# Altium project Mach_PLC_V1.0.PrjPcb
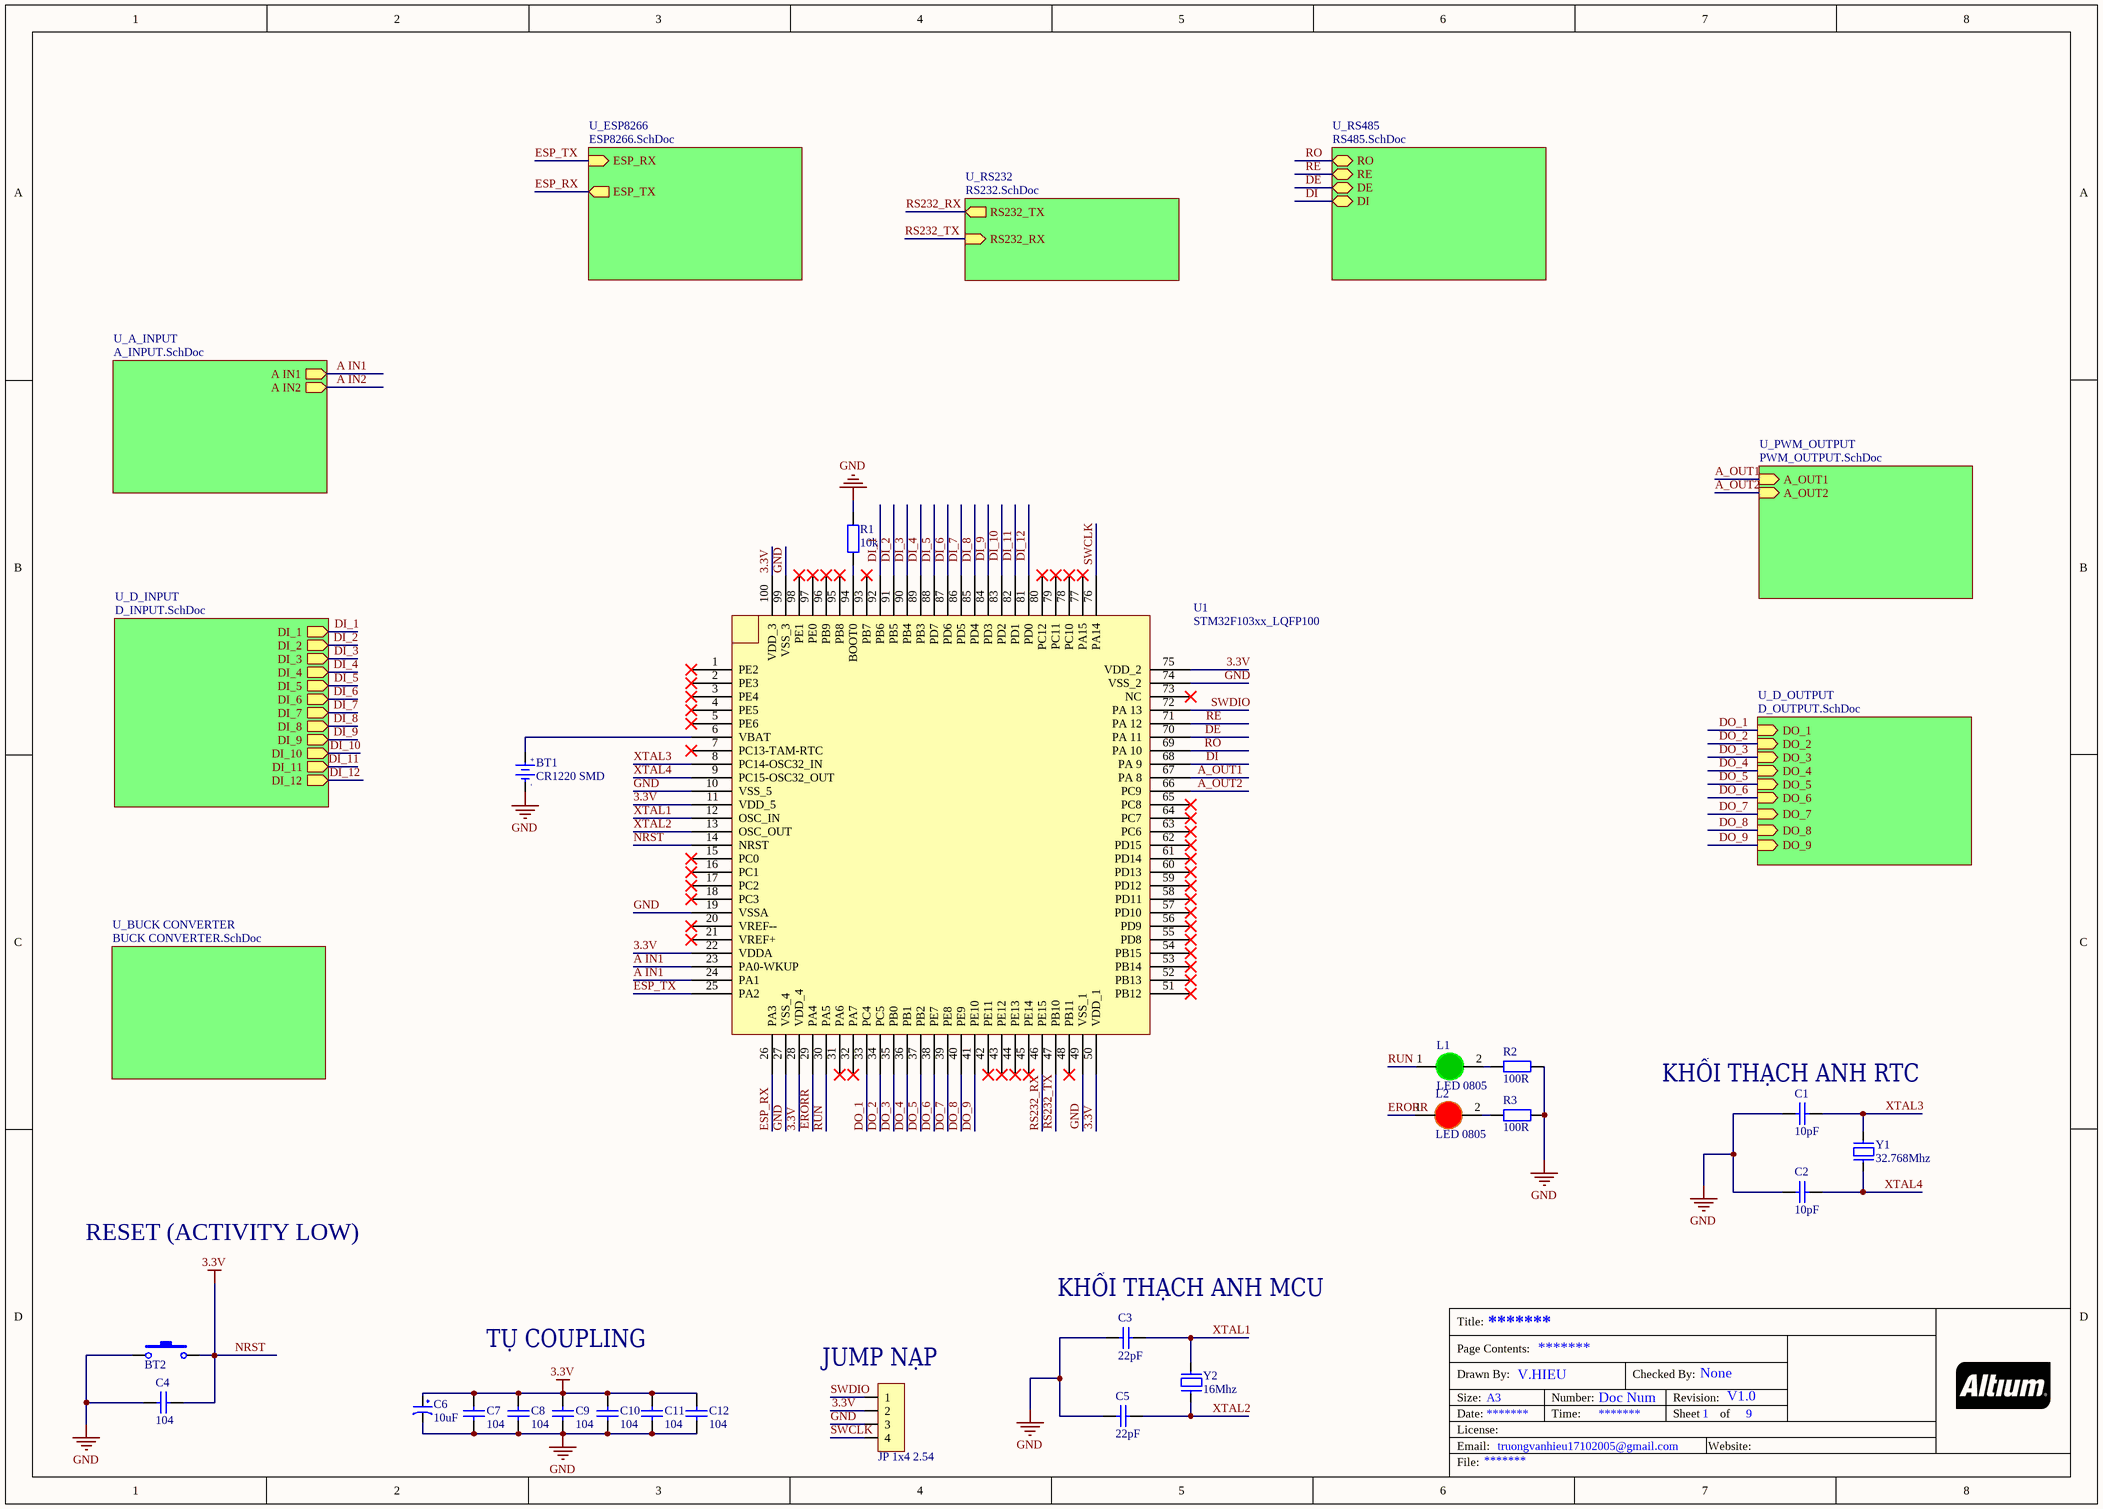
[diagram p0: Mach_PLC.SchDoc]
9 sheets, 145 parts. Net scope: hierarchical (ports join the sheet entries above them; power ports are global).
Board file: Mach_PLC.PcbDoc
Sheets:
  Mach_PLC.SchDoc
    U_D_OUTPUT = D_OUTPUT.SchDoc
    U_D_INPUT = D_INPUT.SchDoc
    U_RS232 = RS232.SchDoc
    U_RS485 = RS485.SchDoc
    U_ESP8266 = ESP8266.SchDoc
    U_A_INPUT = A_INPUT.SchDoc
    U_PWM_OUTPUT = PWM_OUTPUT.SchDoc
    U_BUCK CONVERTER = BUCK CONVERTER.SchDoc

## Sheet Mach_PLC.SchDoc
size A3; Date: *******; ApprovedBy: *******; CheckedBy: None; Author: *******; CompanyName: *******; DrawnBy: V.HIEU; Engineer: *******; Organization: *******; Address2: *******; Address3: *******; Address4: *******; DocumentNumber: Doc Num; Revision: V1.0; Email: truongvanhieu17102005@gmail.com; SheetNumber: 1; SheetTotal: 9; CurrentTime: *******; CurrentDate: *******; Time: *******; DocumentFullPathAndName: *******; DocumentName: *******; ModifiedDate: *******; ImagePath: *******; ProjectName: *******; Application_BuildNumber: *******

### Parts
BT1  CR1220 SMD  [DE PIN CR1220]
BT2  Nut Nhan 2 Chan SMD 3x6x2.5  [Nut Nhan 2 Chan SMD 3x6x2.5]  (value not drawn)
C1  10pF  [tu 0805]
C2  10pF  [tu 0805]
C3  22pF  [tu 0805]
C4  104  [tu 0805]
C5  22pF  [tu 0805]
C6  10uF  [tu tantalum smd3216]
C7  104  [tu 0805]
C8  104  [tu 0805]
C9  104  [tu 0805]
C10  104  [tu 0805]
C11  104  [tu 0805]
C12  104  [tu 0805]
JP1  JP 1x4 2.54  [JP 1x4 DT]
L1  LED 0805  [LED-0805-Green]
L2  LED 0805  [LED-0805-Red]
R1  10k  [tro smd 0805]
R2  100R  [tro smd 0805]
R3  100R  [tro smd 0805]
U1  STM32F103xx_LQFP100  [STM32_LQFP100]
Y1  32.768Mhz  [Thach Anh 2 Chan 32,768 KHz]
Y2  16Mhz  [Thach Anh 2 chan SMD]

### Sub-sheets
U_A_INPUT = A_INPUT.SchDoc: A IN1 (out), A IN2 (out)
U_BUCK CONVERTER = BUCK CONVERTER.SchDoc: no entries
U_D_INPUT = D_INPUT.SchDoc: DI_1 (out), DI_2 (out), DI_3 (out), DI_4 (out), DI_5 (out), DI_6 (out), DI_7 (out), DI_8 (out), DI_9 (out), DI_10 (out), DI_11 (out), DI_12 (out)
U_D_OUTPUT = D_OUTPUT.SchDoc: DO_1 (in), DO_2 (in), DO_3 (in), DO_4 (in), DO_9 (in), DO_5 (in), DO_8 (in), DO_7 (in), DO_6 (in)
U_ESP8266 = ESP8266.SchDoc: ESP_TX (out), ESP_RX (in)
U_PWM_OUTPUT = PWM_OUTPUT.SchDoc: A_OUT1 (in), A_OUT2 (in)
U_RS232 = RS232.SchDoc: RS232_RX (in), RS232_TX (out)
U_RS485 = RS485.SchDoc: RO (bidir), RE (bidir), DE (bidir), DI (bidir)

### Nets
3.3V: BT2.2 C4.2 C6.1 C7.1 C8.1 C9.1 C10.1 C11.1 C12.1 JP1.2 U1.11(VDD_5) U1.14(NRST) U1.22(VDDA) U1.28(VDD_4) U1.50(VDD_1) U1.75(VDD_2) U1.100(VDD_3)  [also labelled NRST]
GND: BT1.2(GND) BT2.1 C1.2 C2.2 C3.2 C4.1 C5.2 C6.2 C7.2 C8.2 C9.2 C10.2 C11.2 C12.2 JP1.3 R1.2 R2.2 R3.2 U1.10(VSS_5) U1.19(VSSA) U1.27(VSS_4) U1.49(VSS_1) U1.74(VSS_2) U1.99(VSS_3)
A IN1: U1.23(PA0-WKUP) U1.24(PA1) ; sheet U_A_INPUT/A IN1
A_OUT1: U1.67(PA_8) ; sheet U_PWM_OUTPUT/A_OUT1
A_OUT2: U1.66(PC9) ; sheet U_PWM_OUTPUT/A_OUT2
DE: U1.70(PA_11) ; sheet U_RS485/DE
DI: U1.68(PA_9) ; sheet U_RS485/DI
DI_1: U1.92(PB6) ; sheet U_D_INPUT/DI_1
DI_2: U1.91(PB5) ; sheet U_D_INPUT/DI_2
DI_3: U1.90(PB4) ; sheet U_D_INPUT/DI_3
DI_4: U1.89(PB3) ; sheet U_D_INPUT/DI_4
DI_5: U1.88(PD7) ; sheet U_D_INPUT/DI_5
DI_6: U1.87(PD6) ; sheet U_D_INPUT/DI_6
DI_7: U1.86(PD5) ; sheet U_D_INPUT/DI_7
DI_8: U1.85(PD4) ; sheet U_D_INPUT/DI_8
DI_9: U1.84(PD3) ; sheet U_D_INPUT/DI_9
DI_10: U1.83(PD2) ; sheet U_D_INPUT/DI_10
DI_11: U1.82(PD1) ; sheet U_D_INPUT/DI_11
DI_12: U1.81(PD0) ; sheet U_D_INPUT/DI_12
DO_1: U1.33(PC4) ; sheet U_D_OUTPUT/DO_1
DO_2: U1.34(PC5) ; sheet U_D_OUTPUT/DO_2
DO_3: U1.35(PB0) ; sheet U_D_OUTPUT/DO_3
DO_4: U1.36(PB1) ; sheet U_D_OUTPUT/DO_4
DO_5: U1.37(PB2) ; sheet U_D_OUTPUT/DO_5
DO_6: U1.38(PE7) ; sheet U_D_OUTPUT/DO_6
DO_7: U1.39(PE8) ; sheet U_D_OUTPUT/DO_7
DO_8: U1.40(PE9) ; sheet U_D_OUTPUT/DO_8
DO_9: U1.41(PE10) ; sheet U_D_OUTPUT/DO_9
ERORR: L2.1(A) U1.29(PA4)
ESP_RX: U1.26(PA3) ; sheet U_ESP8266/ESP_TX
ESP_TX: U1.25(PA2) ; sheet U_ESP8266/ESP_RX
RE: U1.71(PA_12) ; sheet U_RS485/RE
RO: U1.69(PA_10) ; sheet U_RS485/RO
RS232_RX: U1.46(PE15) ; sheet U_RS232/RS232_TX
RS232_TX: U1.47(PB10) ; sheet U_RS232/RS232_RX
RUN: L1.1(A) U1.30(PA5)
SWCLK: JP1.4 U1.76(PA14)
SWDIO: JP1.1 U1.72(PA_13)
XTAL1: C3.1 U1.12(OSC_IN) Y2.2
XTAL2: C5.1 U1.13(OSC_OUT) Y2.1
XTAL3: C1.1 U1.8(PC14-OSC32_IN) Y1.2
XTAL4: C2.1 U1.9(PC15-OSC32_OUT) Y1.1
NetBT1_1: BT1.1(+3V) U1.6(VBAT)
NetL1_2: L1.2(K) R2.1
NetL2_2: L2.2(K) R3.1
NetR1_1: R1.1 U1.94(BOOT0)

Not connected (* = marked no-connect by the designer): U1 1(PE2)* 2(PE3)* 3(PE4)* 4(PE5)* 5(PE6)* 7(PC13-TAM-RTC)* 15(PC0)* 16(PC1)* 17(PC2)* 18(PC3)* 20(VREF--)* 21(VREF+)* 31(PA6)* 32(PA7)* 42(PE11)* 43(PE12)* 44(PE13)* 45(PE14)* 48(PB11)* 51(PB12)* 52(PB13)* 53(PB14)* 54(PB15)* 55(PD8)* 56(PD9)* 57(PD10)* 58(PD11)* 59(PD12)* 60(PD13)* 61(PD14)* 62(PD15)* 63(PC6)* 64(PC7)* 65(PC8)* 73(NC)* 77(PA15)* 78(PC10)* 79(PC11)* 80(PC12)* 93(PB7)* 95(PB8)* 96(PB9)* 97(PE0)* 98(PE1)*

### Notes on the sheet
- (near C1) KHỐI THẠCH ANH RTC
- RESET (ACTIVITY LOW)
- (near C3) KHỐI THẠCH ANH MCU
- TỤ COUPLING
- (near JP1) JUMP NẠP
- Title:
- Size:
- Drawn By:
- Page Contents:
- A3
- Number:
- Checked By:
- Revision:
- Date:
- File:
- License:
- Email:
- Time:
- Sheet
- Website:
- of
- (in symbol De pin CR1220 SMD) +; -

### Library data of the parts
BT1 = De pin CR1220 SMD: Ten: Đế PIN CR1220 SMD; Ma_Hang: MH000833
BT2 = Nut Nhan 2 Chan SMD 3x6x2.5: Ma_Hang: MH001036; Ten: Nút Nhấn 2 Chân 3x6x2.5MM SMD
C1 C2 = Tu 0805 10pF 50V 10%: Dán; Don_Vi: Con; So_Chan: 2; Ten_Linh_Kien: Tụ 0805 10P 10% 50V; Ma_Hang: MH004554; Chung_Loai: Dán; Kieu_Chan: *
C3 C5 = Tu 0805 22pF 50V 10%: Dán; Don_Vi: Con; So_Chan: 2; Ten_Linh_Kien: Tụ 0805 22P 10% 50V; Ma_Hang: MH004560; Chung_Loai: Dán; Kieu_Chan: *
C4 C7-C12 = Tu 0805 104 50V 10%: Dán; Don_Vi: Con; So_Chan: 2; Ten_Linh_Kien: Tụ 0805 104-100nF 10% 50V; Ma_Hang: MH004551; Chung_Loai: Dán; Kieu_Chan: *
C6 = Tu tantalum 10uF 16V SMD3216: Dán; Don_Vi: Con; So_Chan: 2; Ten_Linh_Kien: Tụ tantalum 106C-10uF 16V SMD3216; Ma_Hang: MH001954; Chung_Loai: Dán; Kieu_Chan: *
JP1 = JP 1x4 2.54 Duc Thang: Cắm; Ten_Linh_Kien: Jump Đơn Đực 2.54MM 1x40P Thẳng 11MM; Don_Vi: Con; Ma_Hang: MH000903; Ghi_Chu: *; Kieu_Chan: *; Chung_Loai: Cắm
L1 = LED 0805 Xanh La: Dán; Don_Vi: Con; Ma_Hang: MH002326; Ten_Linh_Kien: LED 0805 Màu Xanh Lá (Green); Ghi_Chu: *; Kieu_Chan: *; Chung_Loai: Dán
L2 = LED 0805 Do: Dán; Don_Vi: Con; Ma_Hang: MH000897; Ten_Linh_Kien: LED 0805 Màu Đỏ (Red); Ghi_Chu: *; Kieu_Chan: *; Chung_Loai: Dán
R1 = Tro 0805 1% 10k: Dán; Don_Vi: Con; So_Chan: 2; Ten_Linh_Kien: Trở 0805 1% 10k; Ma_Hang: MH005473; Chung_Loai: Dán; Kieu_Chan: *
R2 R3 = Tro 0805 5% 100R: Dán; Don_Vi: Con; So_Chan: 2; Ten_Linh_Kien: Trở 0805 5% 100R; Ma_Hang: MH005251; Chung_Loai: Dán; Kieu_Chan: *
Y1 = Thach Anh 2 chan 32,768 Khz: Crystal For all Crystal 2pin.; Value: 4Mhz
Y2 = Thach Anh 2 chan SMD: Crystal For all Crystal 2pin.; Value: 4Mhz

## Sheet D_OUTPUT.SchDoc
size A3; Date: *******; ApprovedBy: *******; CheckedBy: None; Author: *******; CompanyName: *******; DrawnBy: V.HIEU; Engineer: *******; Organization: *******; Address2: *******; Address3: *******; Address4: *******; DocumentNumber: Doc Num; Revision: V1.0; Email: truongvanhieu17102005@gmail.com; CurrentTime: *******; CurrentDate: *******; Time: *******; DocumentFullPathAndName: *******; DocumentName: *******; ModifiedDate: *******; ImagePath: *******; ProjectName: *******; Application_BuildNumber: *******
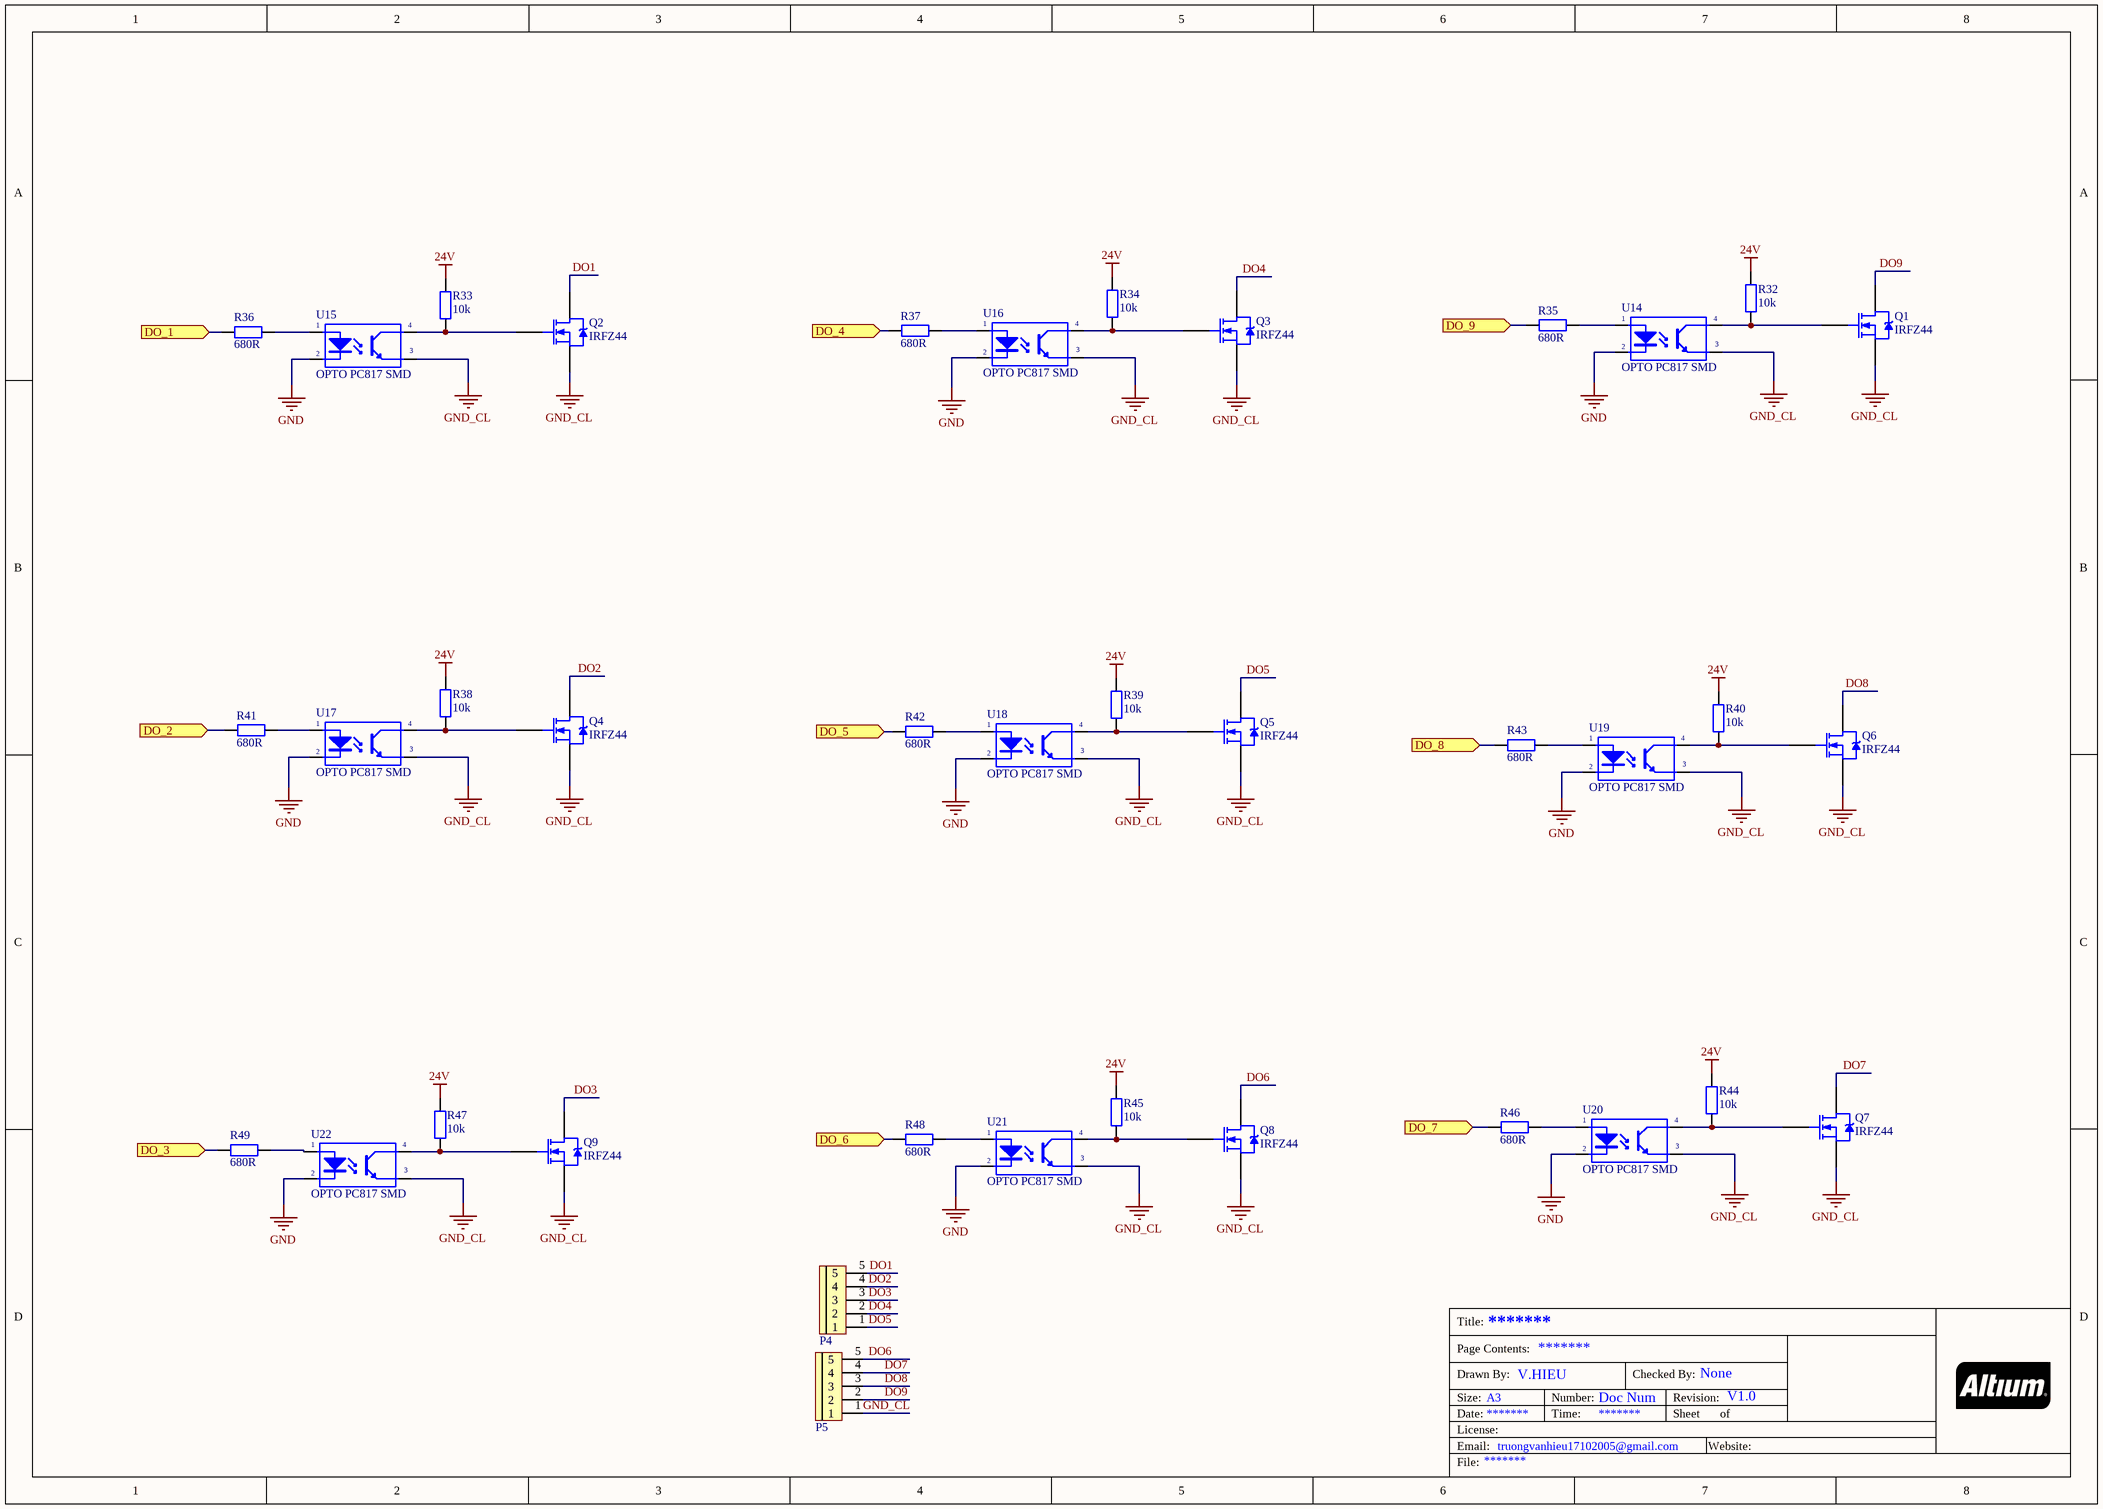
[diagram p1: D_OUTPUT.SchDoc]

### Parts
P4  CON 5 EDG5.08  [CON 5 5EDG5.08]  (value not drawn)
P5  CON 5 EDG5.08  [CON 5 5EDG5.08]  (value not drawn)
Q1  IRFZ44  [TO220]
Q2  IRFZ44  [TO220]
Q3  IRFZ44  [TO220]
Q4  IRFZ44  [TO220]
Q5  IRFZ44  [TO220]
Q6  IRFZ44  [TO220]
Q7  IRFZ44  [TO220]
Q8  IRFZ44  [TO220]
Q9  IRFZ44  [TO220]
R32  10k  [tro smd 0805]
R33  10k  [tro smd 0805]
R34  10k  [tro smd 0805]
R35  680R  [Tro SMD 0805]
R36  680R  [Tro SMD 0805]
R37  680R  [Tro SMD 0805]
R38  10k  [tro smd 0805]
R39  10k  [tro smd 0805]
R40  10k  [tro smd 0805]
R41  680R  [Tro SMD 0805]
R42  680R  [Tro SMD 0805]
R43  680R  [Tro SMD 0805]
R44  10k  [tro smd 0805]
R45  10k  [tro smd 0805]
R46  680R  [Tro SMD 0805]
R47  10k  [tro smd 0805]
R48  680R  [Tro SMD 0805]
R49  680R  [Tro SMD 0805]
U14  OPTO PC817 SMD  [SOP4]
U15  OPTO PC817 SMD  [SOP4]
U16  OPTO PC817 SMD  [SOP4]
U17  OPTO PC817 SMD  [SOP4]
U18  OPTO PC817 SMD  [SOP4]
U19  OPTO PC817 SMD  [SOP4]
U20  OPTO PC817 SMD  [SOP4]
U21  OPTO PC817 SMD  [SOP4]
U22  OPTO PC817 SMD  [SOP4]

### Ports
DO_1 (in), DO_2 (in), DO_3 (in), DO_4 (in), DO_5 (in), DO_6 (in), DO_7 (in), DO_8 (in), DO_9 (in)

### Nets
24V: R32.1 R33.1 R34.1 R38.1 R39.1 R40.1 R44.1 R45.1 R47.1
GND: U14.2(K) U15.2(K) U16.2(K) U17.2(K) U18.2(K) U19.2(K) U20.2(K) U21.2(K) U22.2(K)
GND_CL: P5.1 Q1.3(S) Q2.3(S) Q3.3(S) Q4.3(S) Q5.3(S) Q6.3(S) Q7.3(S) Q8.3(S) Q9.3(S) U14.3(E) U15.3(E) U16.3(E) U17.3(E) U18.3(E) U19.3(E) U20.3(E) U21.3(E) U22.3(E)
DO1: P4.5 Q2.2(D)
DO2: P4.4 Q4.2(D)
DO3: P4.3 Q9.2(D)
DO4: P4.2 Q3.2(D)
DO5: P4.1 Q5.2(D)
DO6: P5.5 Q8.2(D)
DO7: P5.4 Q7.2(D)
DO8: P5.3 Q6.2(D)
DO9: P5.2 Q1.2(D)
DO_1: R36.1 ; port DO_1
DO_2: R41.1 ; port DO_2
DO_3: R49.1 ; port DO_3
DO_4: R37.1 ; port DO_4
DO_5: R42.1 ; port DO_5
DO_6: R48.1 ; port DO_6
DO_7: R46.1 ; port DO_7
DO_8: R43.1 ; port DO_8
DO_9: R35.1 ; port DO_9
NetQ1_1: Q1.1(G) R32.2 U14.4(C)
NetQ2_1: Q2.1(G) R33.2 U15.4(C)
NetQ3_1: Q3.1(G) R34.2 U16.4(C)
NetQ4_1: Q4.1(G) R38.2 U17.4(C)
NetQ5_1: Q5.1(G) R39.2 U18.4(C)
NetQ6_1: Q6.1(G) R40.2 U19.4(C)
NetQ7_1: Q7.1(G) R44.2 U20.4(C)
NetQ8_1: Q8.1(G) R45.2 U21.4(C)
NetQ9_1: Q9.1(G) R47.2 U22.4(C)
NetR35_2: R35.2 U14.1(A)
NetR36_2: R36.2 U15.1(A)
NetR37_2: R37.2 U16.1(A)
NetR41_2: R41.2 U17.1(A)
NetR42_2: R42.2 U18.1(A)
NetR43_2: R43.2 U19.1(A)
NetR46_2: R46.2 U20.1(A)
NetR48_2: R48.2 U21.1(A)
NetR49_2: R49.2 U22.1(A)

### Notes on the sheet
- Title:
- Size:
- Drawn By:
- Page Contents:
- A3
- Number:
- Checked By:
- Revision:
- Date:
- File:
- License:
- Email:
- Time:
- Sheet
- Website:
- of

### Library data of the parts
P4 P5 = CON 5 EDG5.08: Cắm; Ten_Linh_Kien: CON 5 2EDG5.08-5P 5.08MM ( Xanh Cong); Ma_Hang: MH003589; Kieu_Chan: *; Don_Vi: Con; Ghi_Chu: *; Chung_Loai: Cắm
Q1-Q9 = FET IRFZ44 DIP: TO-220
R32-R34 R38-R40 R44 R45 R47 = Tro 0805 1% 10k: as R1 on sheet Mach_PLC; Chung_Loai: Dán; Kieu_Chan: *
R35-R37 R41-R43 R46 R48 R49 = Tro 0805 5% 680R: Dán; Don_Vi: Con; Ma_Hang: MH005344; So_Chan: 2; Ten_Linh_Kien: Trở 0805 5% 680R; Chung_Loai: Dán; Kieu_Chan: *
U14-U22 = OPTO PC817 SMD: Single Opto; Value: PC817

## Sheet D_INPUT.SchDoc
size A3; Date: *******; ApprovedBy: *******; CheckedBy: None; Author: *******; CompanyName: *******; DrawnBy: V.HIEU; Engineer: *******; Organization: *******; Address2: *******; Address3: *******; Address4: *******; DocumentNumber: Doc Num; Revision: V1.0; Email: truongvanhieu17102005@gmail.com; SheetNumber: 3; SheetTotal: 9; CurrentTime: *******; CurrentDate: *******; Time: *******; DocumentFullPathAndName: *******; DocumentName: *******; ModifiedDate: *******; ImagePath: *******; ProjectName: *******; Application_BuildNumber: *******
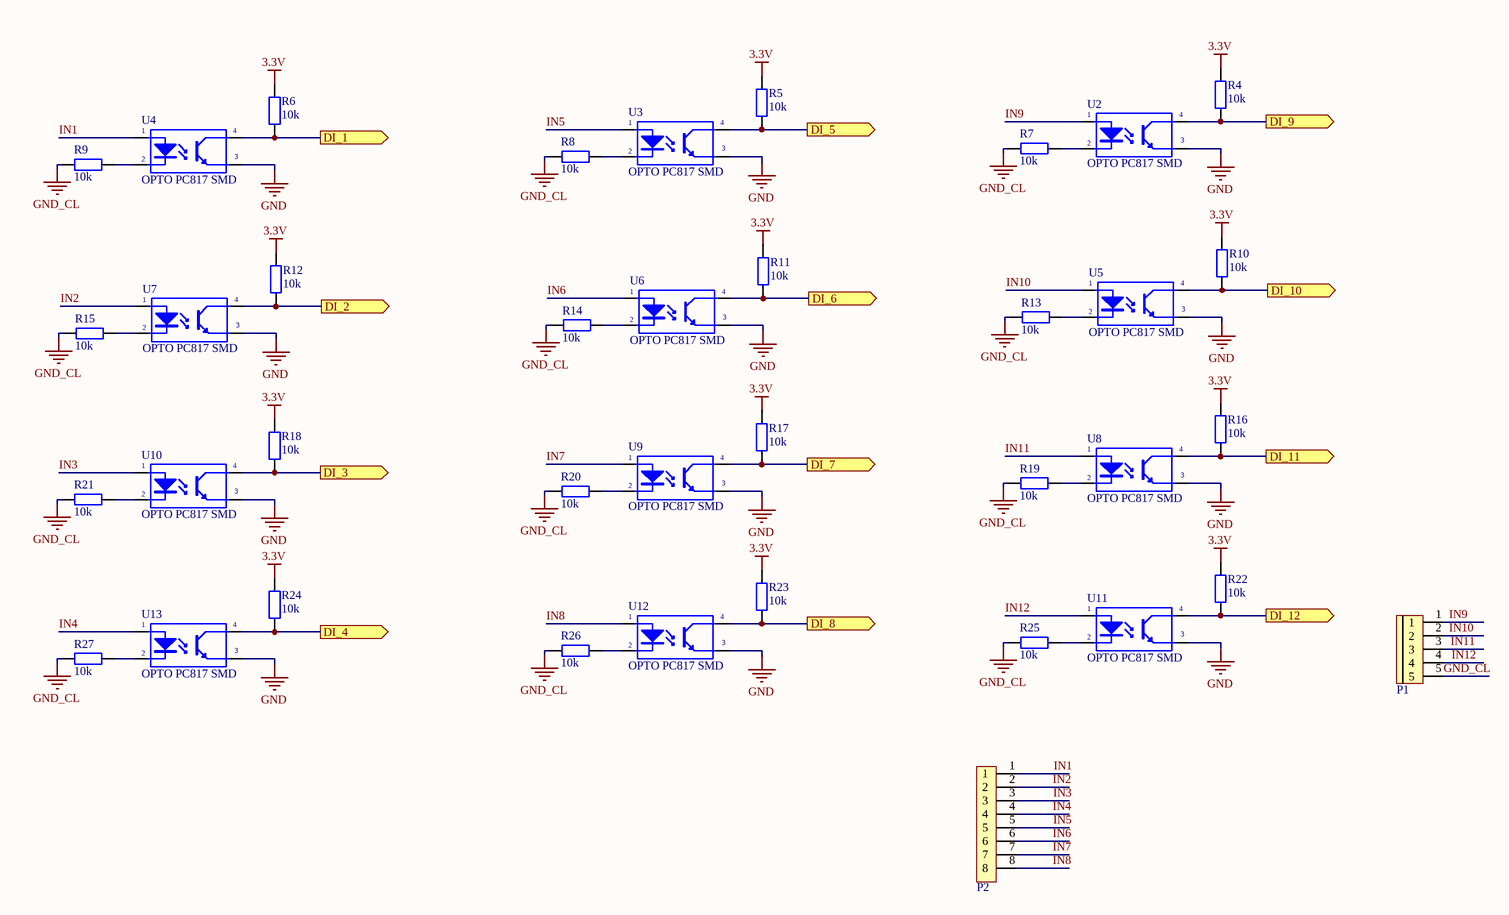
[diagram p2: D_INPUT.SchDoc]

### Parts
P1  CON 5 EDG5.08  [CON 5 5EDG5.08]  (value not drawn)
P2  CON 8 EDG5.08  [CON 8 8EDG5.08]  (value not drawn)
R4  10k  [tro smd 0805]
R5  10k  [tro smd 0805]
R6  10k  [tro smd 0805]
R7  10k  [tro smd 0805]
R8  10k  [tro smd 0805]
R9  10k  [tro smd 0805]
R10  10k  [tro smd 0805]
R11  10k  [tro smd 0805]
R12  10k  [tro smd 0805]
R13  10k  [tro smd 0805]
R14  10k  [tro smd 0805]
R15  10k  [tro smd 0805]
R16  10k  [tro smd 0805]
R17  10k  [tro smd 0805]
R18  10k  [tro smd 0805]
R19  10k  [tro smd 0805]
R20  10k  [tro smd 0805]
R21  10k  [tro smd 0805]
R22  10k  [tro smd 0805]
R23  10k  [tro smd 0805]
R24  10k  [tro smd 0805]
R25  10k  [tro smd 0805]
R26  10k  [tro smd 0805]
R27  10k  [tro smd 0805]
U2  OPTO PC817 SMD  [SOP4]
U3  OPTO PC817 SMD  [SOP4]
U4  OPTO PC817 SMD  [SOP4]
U5  OPTO PC817 SMD  [SOP4]
U6  OPTO PC817 SMD  [SOP4]
U7  OPTO PC817 SMD  [SOP4]
U8  OPTO PC817 SMD  [SOP4]
U9  OPTO PC817 SMD  [SOP4]
U10  OPTO PC817 SMD  [SOP4]
U11  OPTO PC817 SMD  [SOP4]
U12  OPTO PC817 SMD  [SOP4]
U13  OPTO PC817 SMD  [SOP4]

### Ports
DI_1 (out), DI_2 (out), DI_3 (out), DI_4 (out), DI_5 (out), DI_6 (out), DI_7 (out), DI_8 (out), DI_9 (out), DI_10 (out), DI_11 (out), DI_12 (out)

### Nets
3.3V: R4.1 R5.1 R6.1 R10.1 R11.1 R12.1 R16.1 R17.1 R18.1 R22.1 R23.1 R24.1
GND: U2.3(E) U3.3(E) U4.3(E) U5.3(E) U6.3(E) U7.3(E) U8.3(E) U9.3(E) U10.3(E) U11.3(E) U12.3(E) U13.3(E)
GND_CL: P1.5 R7.2 R8.2 R9.2 R13.2 R14.2 R15.2 R19.2 R20.2 R21.2 R25.2 R26.2 R27.2
DI_1: R6.2 U4.4(C) ; port DI_1
DI_2: R12.2 U7.4(C) ; port DI_2
DI_3: R18.2 U10.4(C) ; port DI_3
DI_4: R24.2 U13.4(C) ; port DI_4
DI_5: R5.2 U3.4(C) ; port DI_5
DI_6: R11.2 U6.4(C) ; port DI_6
DI_7: R17.2 U9.4(C) ; port DI_7
DI_8: R23.2 U12.4(C) ; port DI_8
DI_9: R4.2 U2.4(C) ; port DI_9
DI_10: R10.2 U5.4(C) ; port DI_10
DI_11: R16.2 U8.4(C) ; port DI_11
DI_12: R22.2 U11.4(C) ; port DI_12
IN1: P2.1 U4.1(A)
IN2: P2.2 U7.1(A)
IN3: P2.3 U10.1(A)
IN4: P2.4 U13.1(A)
IN5: P2.5 U3.1(A)
IN6: P2.6 U6.1(A)
IN7: P2.7 U9.1(A)
IN8: P2.8 U12.1(A)
IN9: P1.1 U2.1(A)
IN10: P1.2 U5.1(A)
IN11: P1.3 U8.1(A)
IN12: P1.4 U11.1(A)
NetR7_1: R7.1 U2.2(K)
NetR8_1: R8.1 U3.2(K)
NetR9_1: R9.1 U4.2(K)
NetR13_1: R13.1 U5.2(K)
NetR14_1: R14.1 U6.2(K)
NetR15_1: R15.1 U7.2(K)
NetR19_1: R19.1 U8.2(K)
NetR20_1: R20.1 U9.2(K)
NetR21_1: R21.1 U10.2(K)
NetR25_1: R25.1 U11.2(K)
NetR26_1: R26.1 U12.2(K)
NetR27_1: R27.1 U13.2(K)

### Notes on the sheet
- Title:
- Size:
- Drawn By:
- Page Contents:
- A3
- Number:
- Checked By:
- Revision:
- Date:
- File:
- License:
- Email:
- Time:
- Sheet
- Website:
- of

### Library data of the parts
P1 = CON 5 EDG5.08: as P4 on sheet D_OUTPUT; Kieu_Chan: *; Don_Vi: Con; Ghi_Chu: *; Chung_Loai: Cắm
P2 = CON 8 EDG5.08: Cắm; Ten_Linh_Kien: CON 8 2EDG5.08-8P 5.08MM ( Xanh Cong); Ma_Hang: MH000978; Don_Vi: Con; Ghi_Chu: *; Kieu_Chan: *; Chung_Loai: Cắm
R4-R27 = Tro 0805 1% 10k: as R1 on sheet Mach_PLC; Chung_Loai: Dán; Kieu_Chan: *
U2-U13 = OPTO PC817 SMD: Single Opto; Value: PC817

## Sheet RS232.SchDoc
size A3; Date: *******; ApprovedBy: *******; CheckedBy: None; Author: *******; CompanyName: *******; DrawnBy: V.HIEU; Engineer: *******; Organization: *******; Address2: *******; Address3: *******; Address4: *******; DocumentNumber: Doc Num; Revision: V1.0; Email: truongvanhieu17102005@gmail.com; SheetNumber: 7; SheetTotal: 9; CurrentTime: *******; CurrentDate: *******; Time: *******; DocumentFullPathAndName: *******; DocumentName: *******; ModifiedDate: *******; ImagePath: *******; ProjectName: *******; Application_BuildNumber: *******
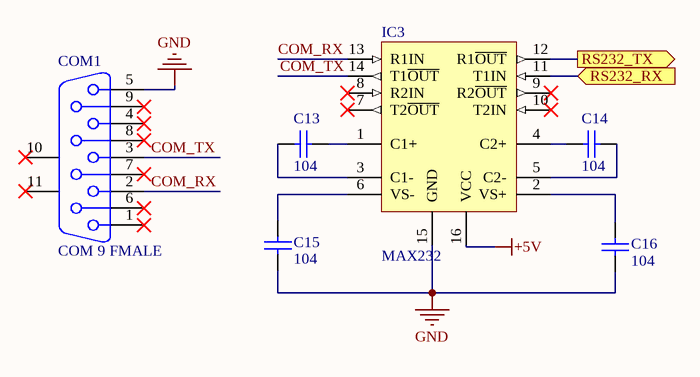
[diagram p3: RS232.SchDoc]

### Parts
C13  104  [tu 0805]
C14  104  [tu 0805]
C15  104  [tu 0805]
C16  104  [tu 0805]
COM1  COM 9 FMALE  [DSB 9-F]
IC3  MAX232  [SO-G16]

### Ports
RS232_RX (in), RS232_TX (out)

### Nets
+5V: IC3.16(VCC)
GND: C15.2 C16.2 COM1.5 IC3.15(GND)
COM_RX: COM1.2 IC3.13(R1IN)
COM_TX: COM1.3 IC3.14(T1~{OUT})
RS232_RX: IC3.12(R1~{OUT}) ; port RS232_TX
RS232_TX: IC3.11(T1IN) ; port RS232_RX
NetC13_1: C13.1 IC3.3(C1-)
NetC13_2: C13.2 IC3.1(C1+)
NetC14_1: C14.1 IC3.5(C2-)
NetC14_2: C14.2 IC3.4(C2+)
NetC15_1: C15.1 IC3.6(VS-)
NetC16_1: C16.1 IC3.2(VS+)

Not connected (* = marked no-connect by the designer): COM1 1* 4* 6* 7* 8* 9* 10(MH1)* 11(MH2)*; IC3 7(T2~{OUT})* 8(R2IN)* 9(R2~{OUT})* 10(T2IN)*

### Notes on the sheet
- Title:
- Size:
- Drawn By:
- Page Contents:
- A3
- Number:
- Checked By:
- Revision:
- Date:
- File:
- License:
- Email:
- Time:
- Sheet
- Website:
- of

### Library data of the parts
C13-C16 = Tu 0805 104 50V 10%: as C4 on sheet Mach_PLC; Chung_Loai: Dán; Kieu_Chan: *
COM1 = DSB9F: COM 9; PackageDocument: O; Positions: 9; Gender: Receptacle; Value: COM 9; Published: 15-Jun-2001; LatestRevisionDate: 17-Jul-2002; LatestRevisionNote: Re-released for DXP Platform.; DatasheetDocument: 1-Sep-1999; PackageReference: 788750; Publisher: Altium Limited; Orientation: Right Angle
IC3 = MAX232: Dual EIA-232 Driver/Receiver; Value: MAX232

## Sheet RS485.SchDoc
size A3; Date: *******; ApprovedBy: *******; CheckedBy: None; Author: *******; CompanyName: *******; DrawnBy: V.HIEU; Engineer: *******; Organization: *******; Address2: *******; Address3: *******; Address4: *******; DocumentNumber: Doc Num; Revision: V1.0; Email: truongvanhieu17102005@gmail.com; CurrentTime: *******; CurrentDate: *******; Time: *******; DocumentFullPathAndName: *******; DocumentName: *******; ModifiedDate: *******; ImagePath: *******; ProjectName: *******; Application_BuildNumber: *******
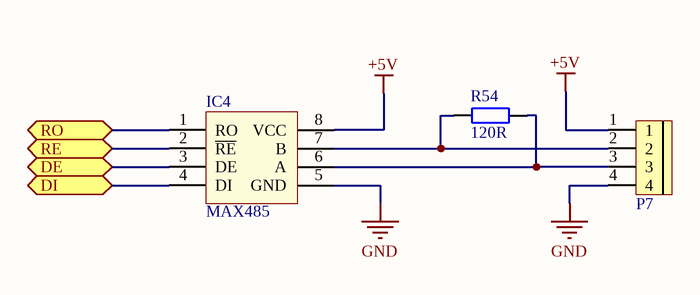
[diagram p4: RS485.SchDoc]

### Parts
IC4  MAX485  [SO-8]
P7  CON 4 EDG5.08  [CON 4 4EDG5.08]  (value not drawn)
R54  120R  [tro smd 0805]

### Ports
DE (bidir), DI (bidir), RE (bidir), RO (bidir)

### Nets
+5V: IC4.8(VCC) P7.1
GND: IC4.5(GND) P7.4
DE: IC4.3(DE) ; port DE
DI: IC4.4(DI) ; port DI
RE: IC4.2(~{RE}) ; port RE
RO: IC4.1(RO) ; port RO
NetIC4_6: IC4.6(A) P7.3 R54.2
NetIC4_7: IC4.7(B) P7.2 R54.1

### Notes on the sheet
- Title:
- Size:
- Drawn By:
- Page Contents:
- A3
- Number:
- Checked By:
- Revision:
- Date:
- File:
- License:
- Email:
- Time:
- Sheet
- Website:
- of

### Library data of the parts
IC4 = MAX485: RS232 - RS485 (Same sn75176)
P7 = CON 4 EDG5.08: Cắm; Ten_Linh_Kien: CON 4 2EDG5.08-4P 5.08MM ( Xanh Cong); Ma_Hang: MH000979; Don_Vi: Con; Ghi_Chu: *; Kieu_Chan: *; Chung_Loai: Cắm
R54 = Tro 0805 5% 120R: Dán; Don_Vi: Con; So_Chan: 2; Ten_Linh_Kien: Trở 0805 5% 120R; Ma_Hang: MH005253; Chung_Loai: Dán; Kieu_Chan: *

## Sheet ESP8266.SchDoc
size A3; Date: *******; ApprovedBy: *******; CheckedBy: None; Author: *******; CompanyName: *******; DrawnBy: V.HIEU; Engineer: *******; Organization: *******; Address2: *******; Address3: *******; Address4: *******; DocumentNumber: Doc Num; Revision: V1.0; Email: truongvanhieu17102005@gmail.com; SheetNumber: 9; SheetTotal: 9; CurrentTime: *******; CurrentDate: *******; Time: *******; DocumentFullPathAndName: *******; DocumentName: *******; ModifiedDate: *******; ImagePath: *******; ProjectName: *******; Application_BuildNumber: *******
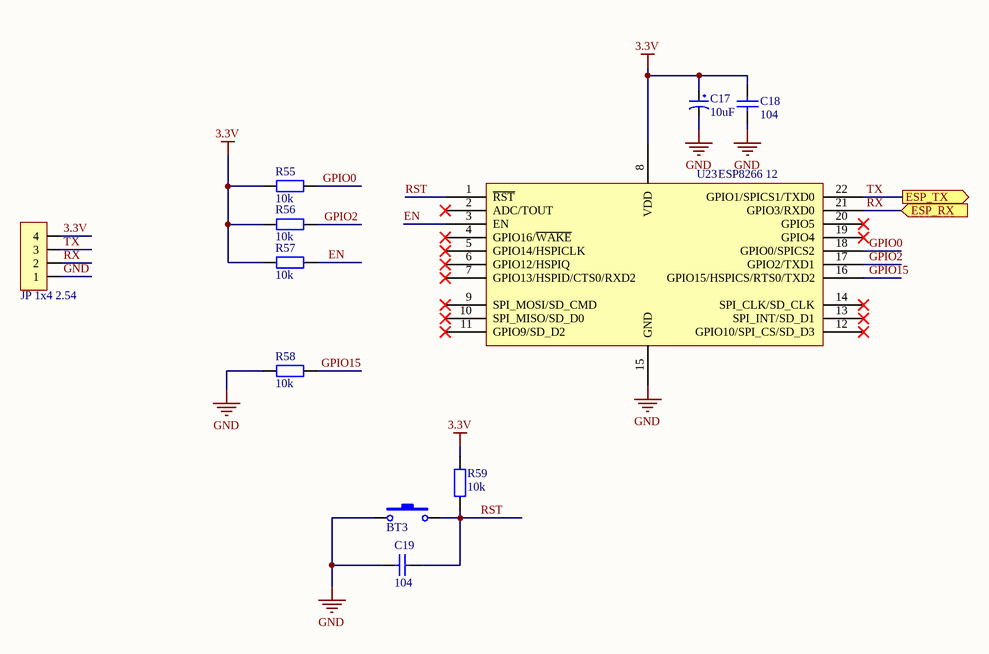
[diagram p5: ESP8266.SchDoc]

### Parts
BT3  Nut Nhan 2 Chan SMD 3x6x2.5  [Nut Nhan 2 Chan SMD 3x6x2.5]  (value not drawn)
C17  10uF  [tu tantalum smd3216]
C18  104  [tu 0603]
C19  104  [tu 0603]
JP2  JP 1x4 2.54  [JP 1x4 DT]
R55  10k  [tro smd 0805]
R56  10k  [tro smd 0805]
R57  10k  [tro smd 0805]
R58  10k  [tro smd 0805]
R59  10k  [tro smd 0805]
U23  ESP8266 12  [ESP8266 12]

### Ports
ESP_RX (in), ESP_TX (out)

### Nets
3.3V: C17.1 C18.1 JP2.4 R55.1 R56.1 R57.1 R59.2 U23.8(VDD)
GND: BT3.1 C17.2 C18.2 C19.1 JP2.1 R58.1 U23.15(GND)
EN: R57.2 U23.3(EN)
GPIO0: R55.2 U23.18(GPIO0/SPICS2)
GPIO2: R56.2 U23.17(GPIO2/TXD1)
GPIO15: R58.2 U23.16(GPIO15/HSPICS/RTS0/TXD2)
RST: BT3.2 C19.2 R59.1 U23.1(~{RST})
RX: JP2.2 U23.21(GPIO3/RXD0) ; port ESP_RX  [project net ESP_TX]
TX: JP2.3 U23.22(GPIO1/SPICS1/TXD0) ; port ESP_TX  [project net ESP_RX]

Not connected (* = marked no-connect by the designer): U23 2(ADC/TOUT)* 4(GPIO16/~{WAKE})* 5(GPIO14/HSPICLK)* 6(GPIO12/HSPIQ)* 7(GPIO13/HSPID/CTS0/RXD2)* 9(SPI_MOSI/SD_CMD)* 10(SPI_MISO/SD_D0)* 11(GPIO9/SD_D2)* 12(GPIO10/SPI_CS/SD_D3)* 13(SPI_INT/SD_D1)* 14(SPI_CLK/SD_CLK)* 19(GPIO4)* 20(GPIO5)*

### Notes on the sheet
- Title:
- Size:
- Drawn By:
- Page Contents:
- A3
- Number:
- Checked By:
- Revision:
- Date:
- File:
- License:
- Email:
- Time:
- Sheet
- Website:
- of

### Library data of the parts
BT3 = Nut Nhan 2 Chan SMD 3x6x2.5: as BT2 on sheet Mach_PLC
C17 = Tu tantalum 10uF 16V SMD3216: as C6 on sheet Mach_PLC; Chung_Loai: Dán; Kieu_Chan: *
C18 C19 = Tu 0603 104 50V 10%: Dán; Don_Vi: Con; So_Chan: 2; Ten_Linh_Kien: Tụ 0603 104-100nF 10% 50V; Ma_Hang: MH004568; Chung_Loai: Dán; Kieu_Chan: *
JP2 = JP 1x4 2.54 Duc Thang: as JP1 on sheet Mach_PLC; Ghi_Chu: *; Kieu_Chan: *; Chung_Loai: Cắm
R55-R59 = Tro 0805 5% 10k: Dán; Don_Vi: Con; So_Chan: 2; Ten_Linh_Kien: Trở 0805 5% 10k; Ma_Hang: MH005239; Chung_Loai: Dán; Kieu_Chan: *
U23 = ESP8266 12: ESP8266 12 22 Pin; IC: ESP8266-EX; Vendor: Ai-thinker

## Sheet A_INPUT.SchDoc
size A3; Date: *******; ApprovedBy: *******; CheckedBy: None; Author: *******; CompanyName: *******; DrawnBy: V.HIEU; Engineer: *******; Organization: *******; Address2: *******; Address3: *******; Address4: *******; DocumentNumber: Doc Num; Revision: V1.0; Email: truongvanhieu17102005@gmail.com; CurrentTime: *******; CurrentDate: *******; Time: *******; DocumentFullPathAndName: *******; DocumentName: *******; ModifiedDate: *******; ImagePath: *******; ProjectName: *******; Application_BuildNumber: *******
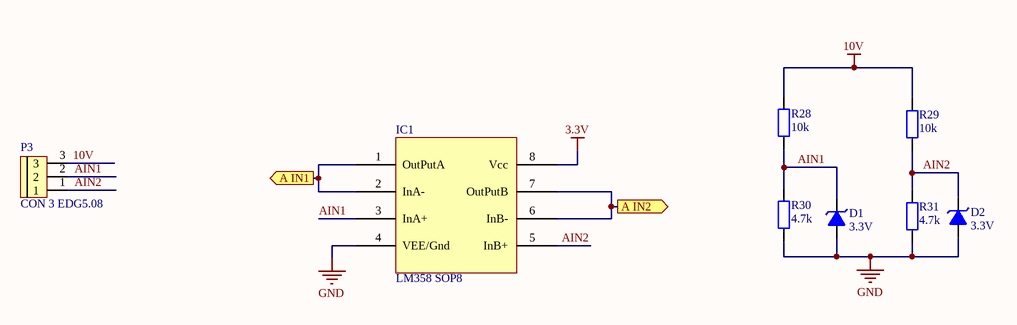
[diagram p6: A_INPUT.SchDoc]

### Parts
D1  3.3V  [DIODE ZENNER SMD SOD80]
D2  3.3V  [DIODE ZENNER SMD SOD80]
IC1  LM358 SOP8  [SOP 8]
P3  CON 3 EDG5.08  [CON 3 3EDG5.08]
R28  10k  [tro smd 0805]
R29  10k  [tro smd 0805]
R30  4.7k  [tro smd 0805]
R31  4.7k  [tro smd 0805]

### Ports
A IN1 (out), A IN2 (out)

### Nets
3.3V: IC1.8(Vcc)
10V: P3.3 R28.2 R29.2
GND: D1.1(A) D2.1(A) IC1.4(VEE/Gnd) R30.1 R31.1
A IN1: IC1.1(OutPutA) IC1.2(InA-) ; port A IN1
A IN2: IC1.6(InB-) IC1.7(OutPutB) ; port A IN2
AIN1: D1.2(K) IC1.3(InA+) P3.2 R28.1 R30.2
AIN2: D2.2(K) IC1.5(InB+) P3.1 R29.1 R31.2

### Notes on the sheet
- Title:
- Size:
- Drawn By:
- Page Contents:
- A3
- Number:
- Checked By:
- Revision:
- Date:
- File:
- License:
- Email:
- Time:
- Sheet
- Website:
- of

### Library data of the parts
D1 D2 = Diode Zener 3.3V: Dán; Don_Vi: Con; Ma_Hang: MH002880; Ten_Linh_Kien: Diode Zener 1/2W 3.3V SMD1206 ZMM3.3; Kieu_Chan: *; Ghi_Chu: *; Chung_Loai: Dán
IC1 = LM358 SOP8: Dán; Ma_Hang: MH000609; Don_Vi: Con; Ten_Linh_Kien: LM358 SOP8; Kieu_Chan: *; Ghi_Chu: *; Chung_Loai: Dán
P3 = CON 3 EDG5.08: Cắm; Ten_Linh_Kien: CON 3 2EDG5.08-3P 5.08MM ( Xanh Cong); Ma_Hang: MH000760; Ghi_Chu: *; Kieu_Chan: *; Don_Vi: Con; Chung_Loai: Cắm
R28 R29 = Tro 0805 5% 10k: as R55 on sheet ESP8266; Chung_Loai: Dán; Kieu_Chan: *
R30 R31 = Tro 0805 5% 4.7k: Dán; Don_Vi: Con; So_Chan: 2; Ten_Linh_Kien: Trở 0805 5% 4.7k; Ma_Hang: MH005307; Chung_Loai: Dán; Kieu_Chan: *

## Sheet PWM_OUTPUT.SchDoc
size A3; Date: *******; ApprovedBy: *******; CheckedBy: None; Author: *******; CompanyName: *******; DrawnBy: V.HIEU; Engineer: *******; Organization: *******; Address2: *******; Address3: *******; Address4: *******; DocumentNumber: Doc Num; Revision: V1.0; Email: truongvanhieu17102005@gmail.com; CurrentTime: *******; CurrentDate: *******; Time: *******; DocumentFullPathAndName: *******; DocumentName: *******; ModifiedDate: *******; ImagePath: *******; ProjectName: *******; Application_BuildNumber: *******
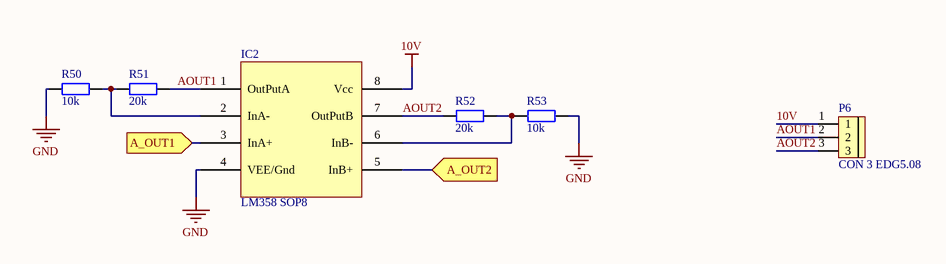
[diagram p7: PWM_OUTPUT.SchDoc]

### Parts
IC2  LM358 SOP8  [SOP 8]
P6  CON 3 EDG5.08  [CON 3 3EDG5.08]
R50  10k  [tro smd 0805]
R51  20k  [tro smd 0805]
R52  20k  [tro smd 0805]
R53  10k  [tro smd 0805]

### Ports
A_OUT1 (in), A_OUT2 (in)

### Nets
10V: IC2.8(Vcc) P6.1
GND: IC2.4(VEE/Gnd) R50.1 R53.2
A_OUT1: IC2.3(InA+) ; port A_OUT1
A_OUT2: IC2.5(InB+) ; port A_OUT2
AOUT1: IC2.1(OutPutA) P6.2 R51.2
AOUT2: IC2.7(OutPutB) P6.3 R52.1
NetIC2_2: IC2.2(InA-) R50.2 R51.1
NetIC2_6: IC2.6(InB-) R52.2 R53.1

### Notes on the sheet
- Title:
- Size:
- Drawn By:
- Page Contents:
- A3
- Number:
- Checked By:
- Revision:
- Date:
- File:
- License:
- Email:
- Time:
- Sheet
- Website:
- of

### Library data of the parts
IC2 = LM358 SOP8: Dán; Ma_Hang: MH000609; Don_Vi: Con; Ten_Linh_Kien: LM358 SOP8; Kieu_Chan: *; Ghi_Chu: *; Chung_Loai: Dán
P6 = CON 3 EDG5.08: as P3 on sheet A_INPUT; Ghi_Chu: *; Kieu_Chan: *; Don_Vi: Con; Chung_Loai: Cắm
R50 R53 = Tro 0805 1% 10k: as R1 on sheet Mach_PLC; Chung_Loai: Dán; Kieu_Chan: *
R51 R52 = Tro 0805 5% 20k: Dán; Don_Vi: Con; So_Chan: 2; Ten_Linh_Kien: Trở 0805 5% 20k; Ma_Hang: MH005247; Chung_Loai: Dán; Kieu_Chan: *

## Sheet BUCK CONVERTER.SchDoc
size A3; Date: *******; ApprovedBy: *******; CheckedBy: None; Author: *******; CompanyName: *******; DrawnBy: V.HIEU; Engineer: *******; Organization: *******; Address2: *******; Address3: *******; Address4: *******; DocumentNumber: Doc Num; Revision: V1.0; Email: truongvanhieu17102005@gmail.com; SheetNumber: 2; SheetTotal: 9; CurrentTime: *******; CurrentDate: *******; Time: *******; DocumentFullPathAndName: *******; DocumentName: *******; ModifiedDate: *******; ImagePath: *******; ProjectName: *******; Application_BuildNumber: *******
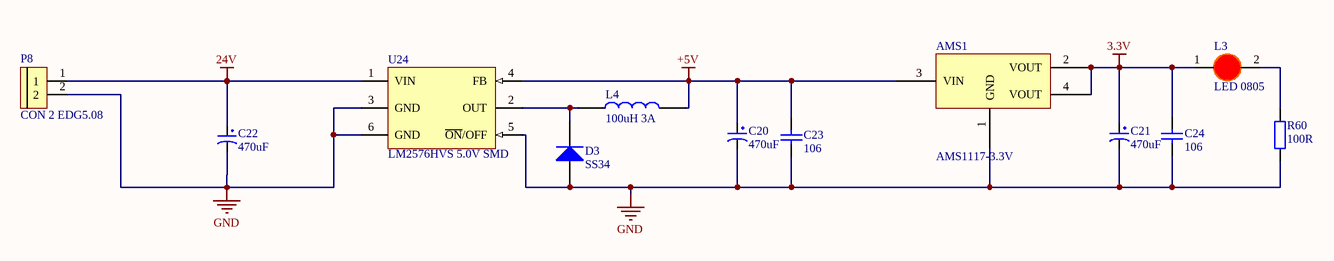
[diagram p8: BUCK CONVERTER.SchDoc]

### Parts
AMS1  AMS1117-3.3V  [SOT223]
C20  470uF  [tu hoa 8mm]
C21  470uF  [tu hoa 8mm]
C22  470uF  [tu hoa 10mm]
C23  106  [tu 0805]
C24  106  [tu 0805]
D3  SS34  [DIODE SMA]
L3  LED 0805  [LED-0805-Red]
L4  100uH 3A  [CUON CAM 100uH3A]
P8  CON 2 EDG5.08  [CON 2 2EDG5.08]
R60  100R  [tro smd 0805]
U24  LM2576HVS 5.0V SMD  [TO263-5]

### Nets
3.3V: AMS1.2(VOUT) AMS1.4(VOUT) C21.1 C24.2 L3.1(A)
24V: C22.1 P8.1 U24.1(VIN)
+5V: AMS1.3(VIN) C20.1 C23.2 L4.2 U24.4(FB)
GND: AMS1.1(GND) C20.2 C21.2 C22.2 C23.1 C24.1 D3.1(A) P8.2 R60.2 U24.3(GND) U24.5(~{ON}/OFF) U24.6(GND)
NetD3_2: D3.2(K) L4.1 U24.2(OUT)
NetL3_2: L3.2(K) R60.1

### Notes on the sheet
- Title:
- Size:
- Drawn By:
- Page Contents:
- A3
- Number:
- Checked By:
- Revision:
- Date:
- File:
- License:
- Email:
- Time:
- Sheet
- Website:
- of

### Library data of the parts
AMS1 = AMS1117 SMD: Dán; Value: AMS1117-3.3V SOT223; Don_Vi: Con; Ma_Hang: MH000596; Ghi_Chu: *; Kieu_Chan: *; Chung_Loai: Dán
C20 C21 = Tu Hoa 470uF 16V 8x11: Cắm; Don_Vi: Con; So_Chan: 2; Ten_Linh_Kien: Tụ Hóa 470uF 16V 8x11MM; Ma_Hang: MH006550; Chung_Loai: Cắm; Kieu_Chan: *
C22 = Tu Hoa 470uF 50V 10x17: Cắm; Don_Vi: Con; So_Chan: 2; Ten_Linh_Kien: Tụ Hóa 470uF 50V; Ma_Hang: MH006866; Chung_Loai: Cắm; Kieu_Chan: *
C23 C24 = Tu 0805 106 16V 10%: Dán; Ten_Linh_Kien: Tụ 0805 106-10uF 10% 16V; So_Chan: 2; Don_Vi: Con; Ma_Hang: MH004553; Chung_Loai: Dán; Kieu_Chan: *
D3 = Diode SS34 ( 1N5822 ): Dán; Don_Vi: Con; Ma_Hang: MH002104; Ten_Linh_Kien: Diode SS34 3A 40V SMA ( 1N5822 SS34A); Kieu_Chan: *; Chung_Loai: Dán
L3 = LED 0805 Do: as L2 on sheet Mach_PLC; Ghi_Chu: *; Kieu_Chan: *; Chung_Loai: Dán
L4 = CUON CAM 100uH DIP: Dán; Don_Vi: Con; Ma_Hang: MH002209; Ten_Linh_Kien: Cuộn Cảm 100uH 3A 8x10MM; Chung_Loai: Dán; Ghi Chu: *; Kieu Chan: *
P8 = CON 2 EDG5.08: Cắm; Ten_Linh_Kien: CON 2 2EDG5.08-2P 5.08MM ( Xanh Cong); Ma_Hang: MH000759; Ghi_Chu: *; Don_Vi: Con; Kieu_Chan: *; Chung_Loai: Cắm
R60 = Tro 0805 5% 100R: as R2 on sheet Mach_PLC; Chung_Loai: Dán; Kieu_Chan: *
U24 = LM2576HVS 5.0V SMD: Dán; Ten_Linh_Kien: LM2576HVS-5.0V BUCK 5V 3A TO263-5; Don_Vi: Con; Ma_Hang: MH002362; Ghi_Chu: *; Kieu_Chan: *; Chung_Loai: Dán

## Nets that join several sheets
3.3V: Mach_PLC (17 pins), D_INPUT (12 pins), ESP8266 (8 pins), A_INPUT (IC1.8), BUCK CONVERTER (5 pins)
10V: A_INPUT (P3.3 R28.2 R29.2), PWM_OUTPUT (IC2.8 P6.1)
24V: D_OUTPUT (9 pins), BUCK CONVERTER (C22.1 P8.1 U24.1)
+5V: RS232 (IC3.16), RS485 (IC4.8 P7.1), BUCK CONVERTER (5 pins)
GND: Mach_PLC (24 pins), D_OUTPUT (9 pins), D_INPUT (12 pins), RS232 (C15.2 C16.2 COM1.5 IC3.15), RS485 (IC4.5 P7.4), ESP8266 (7 pins), A_INPUT (5 pins), PWM_OUTPUT (IC2.4 R50.1 R53.2), BUCK CONVERTER (12 pins)
GND_CL: D_OUTPUT (19 pins), D_INPUT (13 pins)
A IN1: Mach_PLC (U1.23 U1.24), A_INPUT (IC1.1 IC1.2)
A_OUT1: Mach_PLC (U1.67), PWM_OUTPUT (IC2.3)
A_OUT2: Mach_PLC (U1.66), PWM_OUTPUT (IC2.5)
DE: Mach_PLC (U1.70), RS485 (IC4.3)
DI: Mach_PLC (U1.68), RS485 (IC4.4)
DI_1: Mach_PLC (U1.92), D_INPUT (R6.2 U4.4)
DI_2: Mach_PLC (U1.91), D_INPUT (R12.2 U7.4)
DI_3: Mach_PLC (U1.90), D_INPUT (R18.2 U10.4)
DI_4: Mach_PLC (U1.89), D_INPUT (R24.2 U13.4)
DI_5: Mach_PLC (U1.88), D_INPUT (R5.2 U3.4)
DI_6: Mach_PLC (U1.87), D_INPUT (R11.2 U6.4)
DI_7: Mach_PLC (U1.86), D_INPUT (R17.2 U9.4)
DI_8: Mach_PLC (U1.85), D_INPUT (R23.2 U12.4)
DI_9: Mach_PLC (U1.84), D_INPUT (R4.2 U2.4)
DI_10: Mach_PLC (U1.83), D_INPUT (R10.2 U5.4)
DI_11: Mach_PLC (U1.82), D_INPUT (R16.2 U8.4)
DI_12: Mach_PLC (U1.81), D_INPUT (R22.2 U11.4)
DO_1: Mach_PLC (U1.33), D_OUTPUT (R36.1)
DO_2: Mach_PLC (U1.34), D_OUTPUT (R41.1)
DO_3: Mach_PLC (U1.35), D_OUTPUT (R49.1)
DO_4: Mach_PLC (U1.36), D_OUTPUT (R37.1)
DO_5: Mach_PLC (U1.37), D_OUTPUT (R42.1)
DO_6: Mach_PLC (U1.38), D_OUTPUT (R48.1)
DO_7: Mach_PLC (U1.39), D_OUTPUT (R46.1)
DO_8: Mach_PLC (U1.40), D_OUTPUT (R43.1)
DO_9: Mach_PLC (U1.41), D_OUTPUT (R35.1)
ESP_RX: Mach_PLC (U1.26), ESP8266 (JP2.3 U23.22)
ESP_TX: Mach_PLC (U1.25), ESP8266 (JP2.2 U23.21)
RE: Mach_PLC (U1.71), RS485 (IC4.2)
RO: Mach_PLC (U1.69), RS485 (IC4.1)
RS232_RX: Mach_PLC (U1.46), RS232 (IC3.12)
RS232_TX: Mach_PLC (U1.47), RS232 (IC3.11)